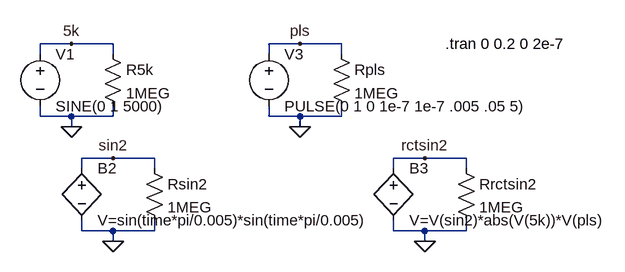
[diagram p0: schematic waveform gen example.asc]
waveform gen example.asc, the LTspice schematic file:
Version 4
SHEET 1 1168 1172
WIRE -1264 832 -1312 832
WIRE -1200 832 -1264 832
WIRE -912 832 -960 832
WIRE -848 832 -912 832
WIRE -1312 848 -1312 832
WIRE -1200 848 -1200 832
WIRE -960 848 -960 832
WIRE -848 848 -848 832
WIRE -1312 944 -1312 928
WIRE -1264 944 -1312 944
WIRE -1200 944 -1200 928
WIRE -1200 944 -1264 944
WIRE -960 944 -960 928
WIRE -912 944 -960 944
WIRE -848 944 -848 928
WIRE -848 944 -912 944
WIRE -1264 960 -1264 944
WIRE -912 960 -912 944
WIRE -1200 1008 -1248 1008
WIRE -1136 1008 -1200 1008
WIRE -720 1008 -768 1008
WIRE -656 1008 -720 1008
WIRE -1248 1024 -1248 1008
WIRE -1136 1024 -1136 1008
WIRE -768 1024 -768 1008
WIRE -656 1024 -656 1008
WIRE -1248 1120 -1248 1104
WIRE -1200 1120 -1248 1120
WIRE -1136 1120 -1136 1104
WIRE -1136 1120 -1200 1120
WIRE -768 1120 -768 1104
WIRE -720 1120 -768 1120
WIRE -656 1120 -656 1104
WIRE -656 1120 -720 1120
WIRE -1200 1136 -1200 1120
WIRE -720 1136 -720 1120
FLAG -1264 960 0
FLAG -1264 832 5k
FLAG -1200 1136 0
FLAG -1200 1008 sin2
FLAG -912 960 0
FLAG -912 832 pls
FLAG -720 1136 0
FLAG -720 1008 rctsin2
SYMBOL res -1216 832 R0
SYMATTR InstName R5k
SYMATTR Value 1MEG
SYMBOL res -1152 1008 R0
SYMATTR InstName Rsin2
SYMATTR Value 1MEG
SYMBOL voltage -960 832 R0
WINDOW 123 0 0 Left 0
WINDOW 39 0 0 Left 0
SYMATTR InstName V3
SYMATTR Value PULSE(0 1 0 1e-7 1e-7 .005 .05 5)
SYMBOL res -864 832 R0
SYMATTR InstName Rpls
SYMATTR Value 1MEG
SYMBOL bv -1248 1008 R0
SYMATTR InstName B2
SYMATTR Value V=sin(time*pi/0.005)*sin(time*pi/0.005)
SYMBOL res -672 1008 R0
SYMATTR InstName Rrctsin2
SYMATTR Value 1MEG
SYMBOL bv -768 1008 R0
SYMATTR InstName B3
SYMATTR Value V=V(sin2)*abs(V(5k))*V(pls)
SYMBOL voltage -1312 832 R0
WINDOW 123 0 0 Left 0
WINDOW 39 0 0 Left 0
SYMATTR InstName V1
SYMATTR Value SINE(0 1 5000)
TEXT -688 832 Left 0 !.tran 0 0.2 0 2e-7

The netlist it stands for:
* waveform gen example.asc
R5k 5k 0 1MEG
Rsin2 sin2 0 1MEG
V3 pls 0 PULSE(0 1 0 1e-7 1e-7 .005 .05 5)
Rpls pls 0 1MEG
B2 sin2 0 V=sin(time*pi/0.005)*sin(time*pi/0.005)
Rrctsin2 rctsin2 0 1MEG
B3 rctsin2 0 V=V(sin2)*abs(V(5k))*V(pls)
V1 5k 0 SINE(0 1 5000)
.tran 0 0.2 0 2e-7
.backanno
.end